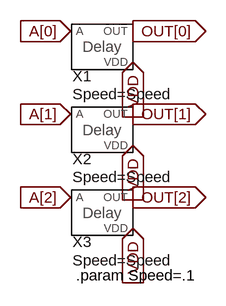
[diagram p0: schematic Gate_Delay[3].asc]
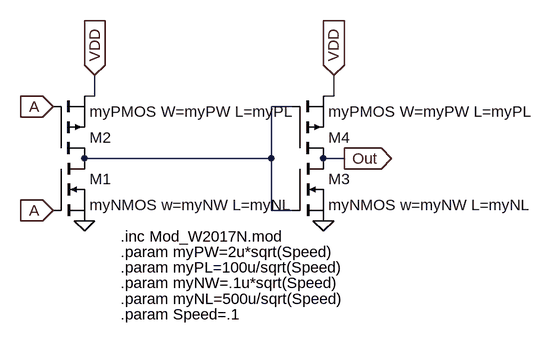
[diagram p1: sub-circuit gate_delay.asc]
Gate_Delay[3].asc, the LTspice schematic file:
Version 4
SHEET 1 880 680
FLAG -112 0 A[0]
IOPIN -112 0 In
FLAG -112 128 A[1]
IOPIN -112 128 In
FLAG -112 256 A[2]
IOPIN -112 256 In
FLAG -16 0 OUT[0]
IOPIN -16 0 Out
FLAG -16 48 VDD
IOPIN -16 48 In
FLAG -16 176 VDD
IOPIN -16 176 In
FLAG -16 304 VDD
IOPIN -16 304 In
FLAG -16 128 OUT[1]
IOPIN -16 128 Out
FLAG -16 256 OUT[2]
IOPIN -16 256 Out
SYMBOL Gate_Delay -64 32 R0
WINDOW 39 -45 65 Left 2
SYMATTR InstName X1
SYMATTR SpiceLine Speed=Speed
SYMBOL Gate_Delay -64 160 R0
WINDOW 39 -45 65 Left 2
SYMATTR InstName X2
SYMATTR SpiceLine Speed=Speed
SYMBOL Gate_Delay -64 288 R0
WINDOW 39 -45 65 Left 2
SYMATTR InstName X3
SYMATTR SpiceLine Speed=Speed
TEXT -104 376 Left 2 !.param Speed=.1

gate_delay.asc, the sub-circuit schematic file:
Version 4
SHEET 1 880 680
WIRE -384 -80 -384 -112
WIRE -384 -80 -400 -80
WIRE -16 -80 -16 -112
WIRE -16 -80 -32 -80
WIRE -80 -64 -112 -64
WIRE -112 16 -112 -64
WIRE -112 16 -400 16
WIRE 0 16 -32 16
WIRE -112 96 -112 16
WIRE -80 96 -112 96
FLAG -384 -112 VDD
IOPIN -384 -112 In
FLAG -400 112 0
FLAG -448 -64 A
IOPIN -448 -64 In
FLAG -448 96 A
IOPIN -448 96 In
FLAG -16 -112 VDD
IOPIN -16 -112 In
FLAG -32 112 0
FLAG 0 16 Out
IOPIN 0 16 Out
SYMBOL nmos -448 16 R0
SYMATTR InstName M1
SYMATTR Value myNMOS w=myNW L=myNL
SYMBOL pmos -448 16 M180
SYMATTR InstName M2
SYMATTR Value myPMOS W=myPW L=myPL
SYMBOL nmos -80 16 R0
SYMATTR InstName M3
SYMATTR Value myNMOS w=myNW L=myNL
SYMBOL pmos -80 16 M180
SYMATTR InstName M4
SYMATTR Value myPMOS W=myPW L=myPL
TEXT -344 136 Left 2 !.inc Mod_W2017N.mod
TEXT -344 160 Left 2 !.param myPW=2u*sqrt(Speed)
TEXT -344 184 Left 2 !.param myPL=100u/sqrt(Speed)
TEXT -344 208 Left 2 !.param myNW=.1u*sqrt(Speed)
TEXT -344 232 Left 2 !.param myNL=500u/sqrt(Speed)
TEXT -344 256 Left 2 !.param Speed=.1

The netlist it stands for:
* Gate_Delay[3].asc
XX1 A[0] VDD OUT[0] gate_delay params: Speed=Speed
XX2 A[1] VDD OUT[1] gate_delay params: Speed=Speed
XX3 A[2] VDD OUT[2] gate_delay params: Speed=Speed

* block symbol definitions
.subckt gate_delay A VDD OUT
M1 N001 A 0 0 myNMOS w=myNW L=myNL
M2 N001 A VDD VDD myPMOS W=myPW L=myPL
M3 Out N001 0 0 myNMOS w=myNW L=myNL
M4 Out N001 VDD VDD myPMOS W=myPW L=myPL
.inc Mod_W2017N.mod
.param myPW=2u*sqrt(Speed)
.param myPL=100u/sqrt(Speed)
.param myNW=.1u*sqrt(Speed)
.param myNL=500u/sqrt(Speed)
.param Speed=.1
.ends gate_delay

.model NMOS NMOS
.model PMOS PMOS
.lib standard.mos
.param Speed=.1
.backanno
.end